# EAGLE design schéma_Carte_Puissance (EAGLE 9.6.2)
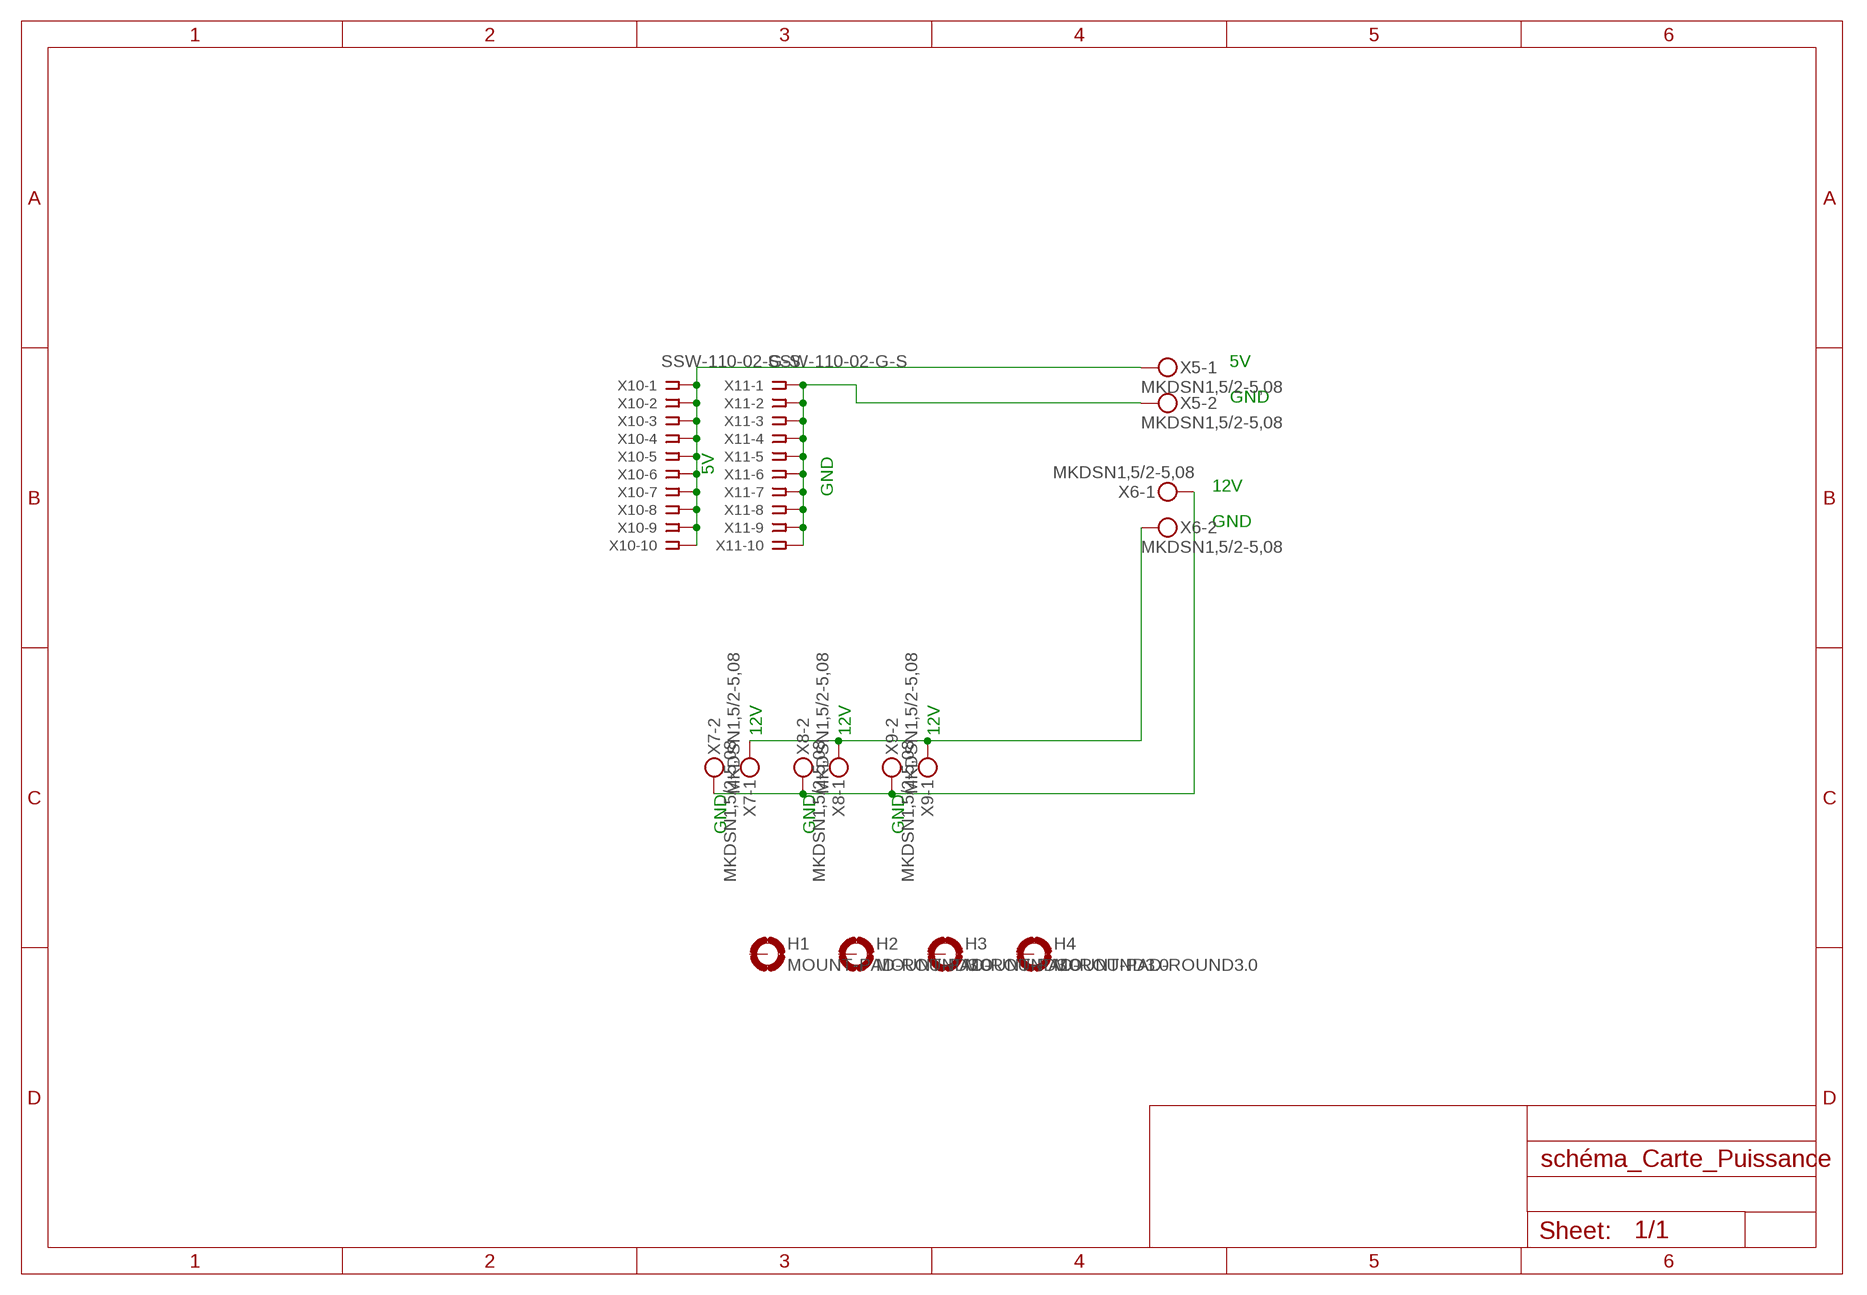
[diagram p0: schematic, sheet 1]

## Parts
H1  MOUNT-PAD-ROUND3.0  [3,0-PAD]
H2  MOUNT-PAD-ROUND3.0  [3,0-PAD]
H3  MOUNT-PAD-ROUND3.0  [3,0-PAD]
H4  MOUNT-PAD-ROUND3.0  [3,0-PAD]
X5  MKDSN1,5/2-5,08  [MKDSN1,5/2-5,08]
X6  MKDSN1,5/2-5,08  [MKDSN1,5/2-5,08]
X7  MKDSN1,5/2-5,08  [MKDSN1,5/2-5,08]
X8  MKDSN1,5/2-5,08  [MKDSN1,5/2-5,08]
X9  MKDSN1,5/2-5,08  [MKDSN1,5/2-5,08]
X10  SSW-110-02-G-S  [SSW-110-02-G-S]
X11  SSW-110-02-G-S  [SSW-110-02-G-S]

## Nets
N$1: X5.1 X10.1 X10.2 X10.3 X10.4 X10.5 X10.6 X10.7 X10.8 X10.9 X10.10
N$2: X5.2 X11.1 X11.2 X11.3 X11.4 X11.5 X11.6 X11.7 X11.8 X11.9 X11.10
N$3: X6.2 X7.1 X8.1 X9.1
N$4: X6.1 X7.2 X8.2 X9.2
Unconnected: H1.B3,0(MOUNT) H2.B3,0(MOUNT) H3.B3,0(MOUNT) H4.B3,0(MOUNT)

## Notes on the sheet
- 5V
- GND
- GND
- 5V
- 12V
- GND
- 12V | 12V | 12V
- GND | GND | GND

## Library data of the parts
H1-H4 = holes:MOUNT-PAD-ROUND: MOUNTING PAD, round
X5-X9 = con-phoenix-508:MKDSN1,5/2-5,08: MKDSN 1,5/ 2-5,08 Printklemme Nennstrom: 13,5 A Nennspannung: 250 V Rastermaß: 5,08 mm Polzahl: 2 Anschlussart: Schraubanschluss Montage: Löten Anschlussrichtung Leiter/Platine: 0 ° Artikelnummer: 1729128 Source: http://eshop.phoenixcontact.com .. 1729128.pdf
X10 X11 = con-samtec:SSW-110-02-G-S: THROUGH-HOLE .025" SQ POST SOCKET Source: Samtec SSW.pdf; MF: Samtec Inc.; MPN: SSW-110-02-G-S; OC_FARNELL: unknown; OC_NEWARK: 11P9482

## Board
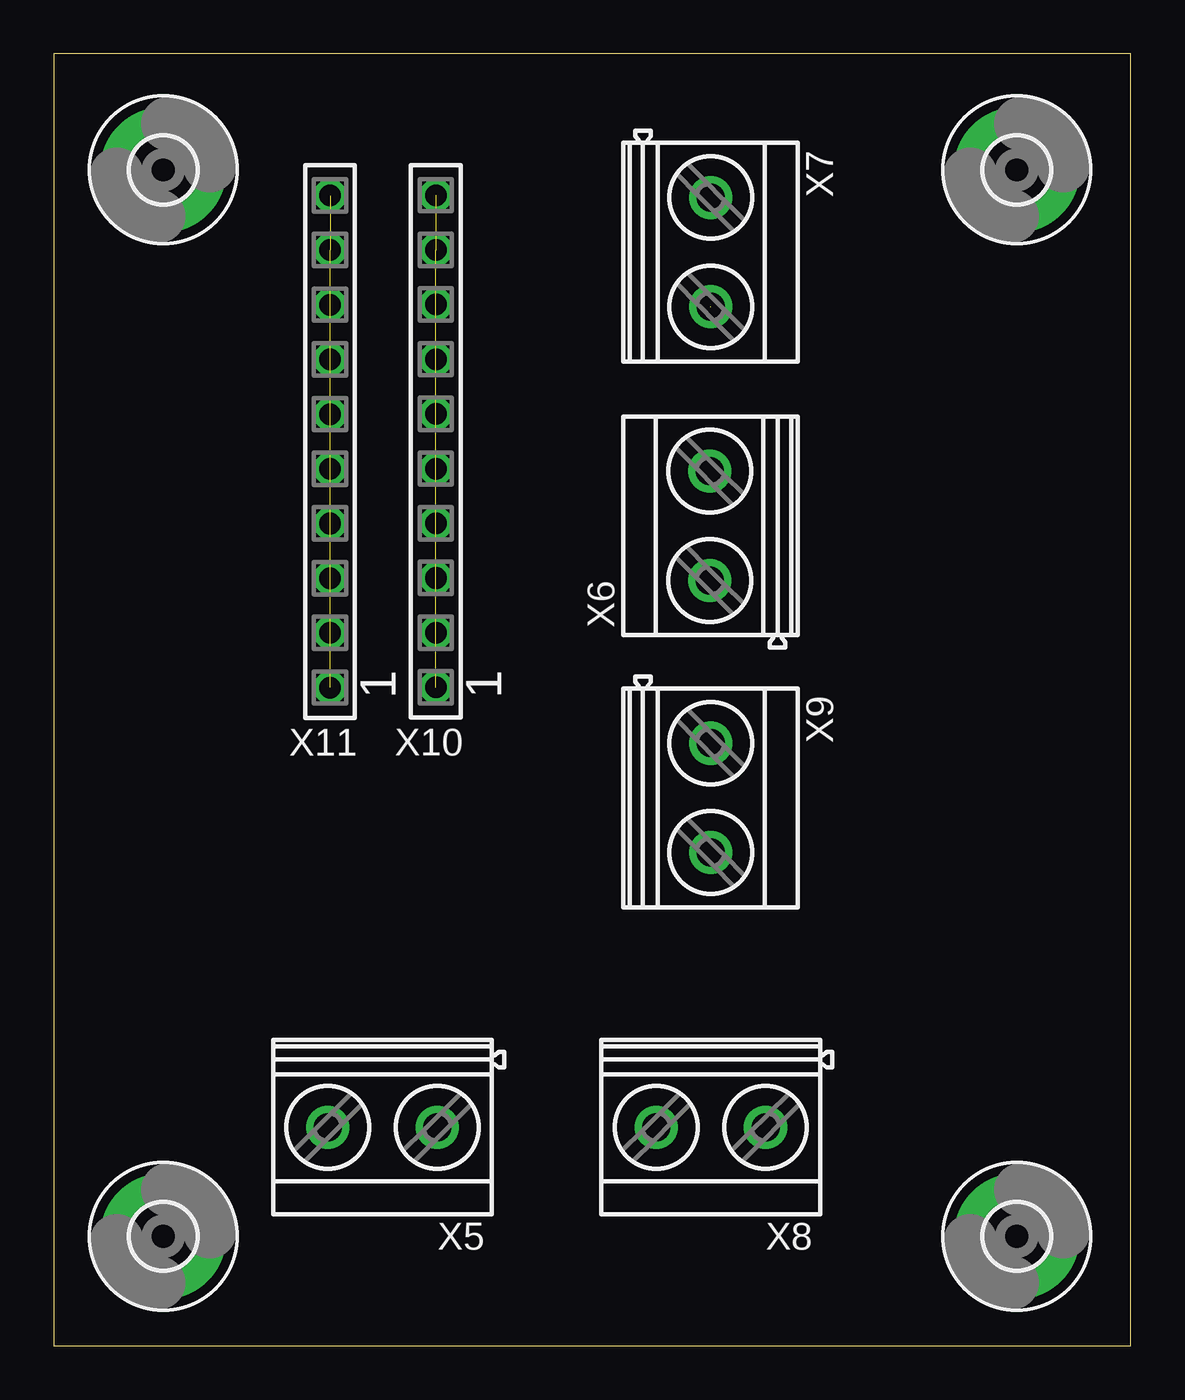
[diagram p1: board, top side]
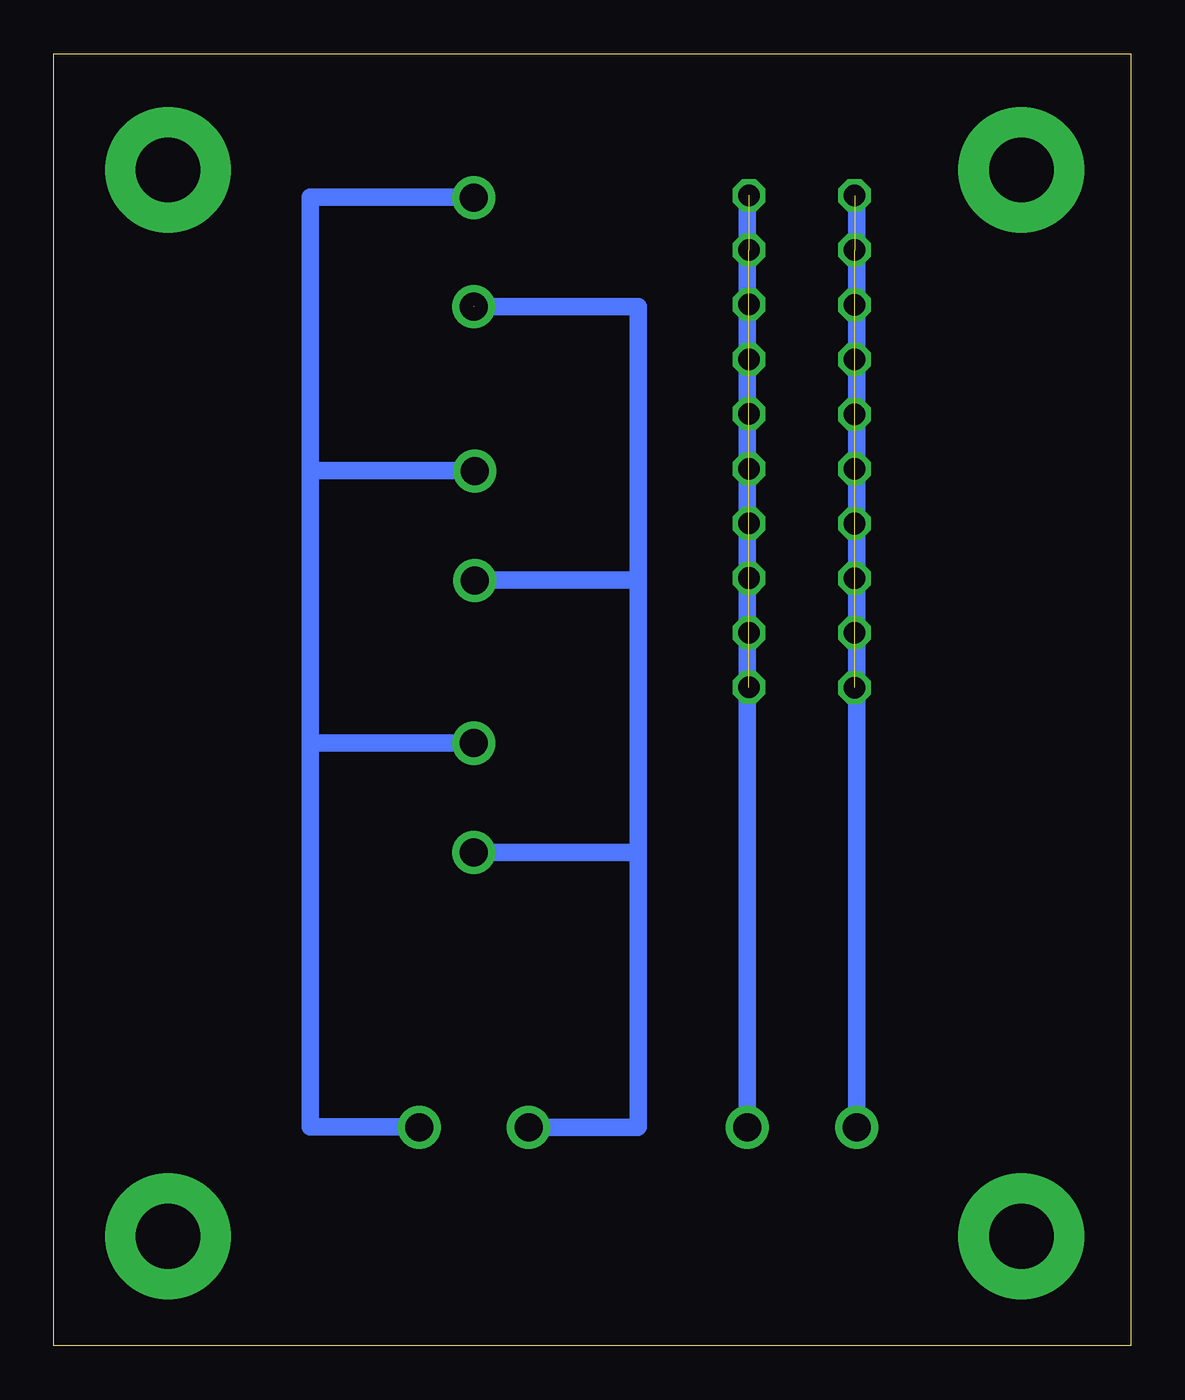
[diagram p2: board, bottom side, seen from below]

Size 50 x 60 mm. Coordinates in mm from the lower left corner, seen from the top.
Outline: 0,0 50,0 50,60 0,60 0,0
Copper layers (1*16): Top 0.035mm / dielectric 1.5mm / Bottom 0.035mm
Design rules "default": minimum track width 6mil, minimum drill 0.35mm, track to track 6mil, track to pad 6mil, pad to pad 6mil, via to via 6mil, smd to smd 6mil, copper to edge 40mil, drill to drill 6mil, minimum pad ring 10mil, minimum via ring 8mil, stop-mask expansion 4mil, vias tented up to drill 0mil, thermal gap 10mil

### Footprints (pad centres in the part's own frame; a part is rotated, then mirrored left to right if it is on the bottom)
3,0-PAD = drill 3 pad 5.842: B3,0 0,0
MKDSN1,5/2-5,08 = drill 1.3 pad 2: 1 -2.561,0.025; 2 2.519,0.025
SSW-110-02-G-S = drill 1 pad 1.5 octagon: 1 -11.43,0; 2 -8.89,0; 3 -6.35,0; 4 -3.81,0; 5 -1.27,0; 6 1.27,0; 7 3.81,0; 8 6.35,0; 9 8.89,0; 10 11.43,0

### Placement (x,y rotation side)
H1  44.7,5.08 0 top
H2  5.08,5.08 0 top
H3  44.7,54.61 0 top
H4  5.08,54.61 0 top
X5  15.24,10.16 180 top
X6  30.48,38.1 90 top
X7  30.48,50.77 270 top
X8  30.48,10.16 180 top
X9  30.48,25.42 270 top
X10  17.73,42 90 top
X11  12.82,41.99 90 top

### Tracks (layer width: path | path; a pad name or v marks a point on that pad's centre or on a via)
N$1  (9 unrouted)
  Bottom 0.813: X5.1 17.8,53.36 X10.10
N$2  (9 unrouted)
  Top 0.152: X5.2 12.54,10.31
  Bottom 0.813: X5.2 12.72,53.32 X11.10
N$3
  Bottom 0.813: X8.1 33.07,10.16 38.1,10.16 38.1,27.94 | 38.1,27.94 38.06,27.98 X9.1 | 38.1,40.64 30.48,40.64 X6.2 | 38.1,27.94 38.1,40.64 | 38.1,40.64 38.1,53.34 30.52,53.34 X7.1
N$4  (1 unrouted)
  Bottom 0.813: X8.2 22.89,10.13 22.86,10.16 22.86,22.86 | 22.86,22.86 22.9,22.9 X9.2 | 22.86,22.86 22.86,35.56 | 22.86,35.56 30.43,35.56 X6.1 | 22.86,35.56 22.86,48.26 30.48,48.26

### Text on the board
Bottom: PING37